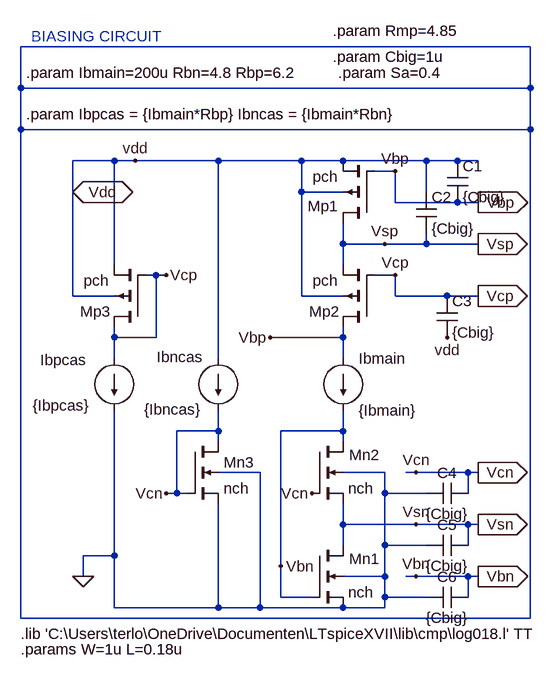
[diagram p0: schematic Biasing_circuit.asc]
Biasing_circuit.asc, the LTspice schematic file:
Version 4
SHEET 1 3816 872
WIRE 1984 -160 1200 -160
WIRE 1200 -96 1200 -160
WIRE 1984 -96 1984 -160
WIRE 1984 -96 1200 -96
WIRE 1200 -32 1200 -96
WIRE 1984 -32 1984 -96
WIRE 1984 -32 1200 -32
WIRE 1344 16 1280 16
WIRE 1376 16 1344 16
WIRE 1504 16 1376 16
WIRE 1632 16 1504 16
WIRE 1696 16 1632 16
WIRE 1824 16 1696 16
WIRE 1872 16 1824 16
WIRE 1904 16 1872 16
WIRE 1776 32 1744 32
WIRE 1280 64 1280 16
WIRE 1632 64 1632 16
WIRE 1696 64 1632 64
WIRE 1824 64 1824 16
WIRE 1776 80 1776 32
WIRE 1872 80 1776 80
WIRE 1904 80 1872 80
WIRE 1696 144 1696 112
WIRE 1760 144 1696 144
WIRE 1824 144 1824 128
WIRE 1824 144 1760 144
WIRE 1904 144 1824 144
WIRE 1344 176 1344 16
WIRE 1696 176 1696 144
WIRE 1408 192 1392 192
WIRE 1424 192 1408 192
WIRE 1776 192 1744 192
WIRE 1280 224 1280 64
WIRE 1344 224 1280 224
WIRE 1632 224 1632 64
WIRE 1696 224 1632 224
WIRE 1776 224 1776 192
WIRE 1856 224 1776 224
WIRE 1904 224 1856 224
WIRE 1344 288 1344 272
WIRE 1408 288 1408 192
WIRE 1408 288 1344 288
WIRE 1696 288 1696 272
WIRE 1696 288 1584 288
WIRE 1344 320 1344 288
WIRE 1504 320 1504 16
WIRE 1696 320 1696 288
WIRE 1504 432 1504 400
WIRE 1504 432 1440 432
WIRE 1696 432 1696 400
WIRE 1696 432 1600 432
WIRE 1504 448 1504 432
WIRE 1696 448 1696 432
WIRE 1568 496 1504 496
WIRE 1760 496 1696 496
WIRE 1808 496 1792 496
WIRE 1888 496 1808 496
WIRE 1904 496 1888 496
WIRE 1440 528 1440 432
WIRE 1440 528 1424 528
WIRE 1456 528 1440 528
WIRE 1760 528 1760 496
WIRE 1824 528 1760 528
WIRE 1888 528 1888 496
WIRE 1696 576 1696 544
WIRE 1808 576 1696 576
WIRE 1888 576 1808 576
WIRE 1904 576 1888 576
WIRE 1696 608 1696 576
WIRE 1760 608 1760 528
WIRE 1824 608 1760 608
WIRE 1888 608 1888 576
WIRE 1344 624 1344 400
WIRE 1344 624 1296 624
WIRE 1600 640 1600 432
WIRE 1296 656 1296 624
WIRE 1760 656 1760 608
WIRE 1760 656 1696 656
WIRE 1808 656 1792 656
WIRE 1888 656 1808 656
WIRE 1904 656 1888 656
WIRE 1600 688 1600 640
WIRE 1648 688 1600 688
WIRE 1760 688 1760 656
WIRE 1824 688 1760 688
WIRE 1888 688 1888 656
WIRE 1344 704 1344 624
WIRE 1504 704 1504 544
WIRE 1504 704 1344 704
WIRE 1568 704 1568 496
WIRE 1568 704 1504 704
WIRE 1696 704 1568 704
WIRE 1760 704 1760 688
WIRE 1760 704 1696 704
WIRE 1200 720 1200 -32
WIRE 1984 720 1984 -32
WIRE 1984 720 1200 720
FLAG 1376 16 vdd
FLAG 1760 144 Vsp
FLAG 1776 192 Vcp
FLAG 1776 32 Vbp
FLAG 1600 640 Vbn
FLAG 1808 656 Vbn
FLAG 1808 576 Vsn
FLAG 1808 496 Vcn
FLAG 1296 656 0
FLAG 1648 528 Vcn
FLAG 1424 528 Vcn
FLAG 1424 192 Vcp
FLAG 1584 288 Vbp
FLAG 1904 80 Vbp
IOPIN 1904 80 Out
FLAG 1904 144 Vsp
IOPIN 1904 144 Out
FLAG 1904 224 Vcp
IOPIN 1904 224 Out
FLAG 1904 496 Vcn
IOPIN 1904 496 Out
FLAG 1904 576 Vsn
IOPIN 1904 576 Out
FLAG 1904 656 Vbn
IOPIN 1904 656 Out
FLAG 1280 64 Vdd
IOPIN 1280 64 BiDir
FLAG 1856 288 vdd
DATAFLAG 1696 144 "round($*100)/100"
DATAFLAG 1792 80 "round($*100)/100"
SYMBOL nmos4 1648 448 R0
WINDOW 0 57 21 Left 2
SYMATTR InstName Mn2
SYMATTR Value nch
SYMATTR Value2 l={L} w={W} m={Sa*2}
SYMBOL current 1696 320 R0
WINDOW 123 0 0 Left 0
WINDOW 39 0 0 Left 0
SYMATTR InstName Ibmain
SYMATTR Value {Ibmain}
SYMBOL current 1504 320 R0
WINDOW 0 -95 -2 Left 2
WINDOW 3 -114 79 Left 2
WINDOW 123 0 0 Left 0
WINDOW 39 0 0 Left 0
SYMATTR InstName Ibncas
SYMATTR Value {Ibncas}
SYMBOL pmos4 1744 272 R180
WINDOW 0 53 24 Left 2
SYMATTR InstName Mp2
SYMATTR Value pch
SYMATTR Value2 l={L} w={W} m={Sa*Rmp*2}
SYMBOL pmos4 1744 112 R180
WINDOW 0 55 26 Left 2
SYMATTR InstName Mp1
SYMATTR Value pch
SYMATTR Value2 l={L} w={W} m={Sa*Rmp*2}
SYMBOL nmos4 1456 448 R0
SYMATTR InstName Mn3
SYMATTR Value nch
SYMATTR Value2 l={L} w={W} m={Sa*2}
SYMBOL current 1344 320 R0
WINDOW 0 -114 3 Left 2
WINDOW 3 -126 73 Left 2
WINDOW 123 0 0 Left 0
WINDOW 39 0 0 Left 0
SYMATTR InstName Ibpcas
SYMATTR Value {Ibpcas}
SYMBOL pmos4 1392 272 R180
WINDOW 0 53 24 Left 2
SYMATTR InstName Mp3
SYMATTR Value pch
SYMATTR Value2 l={L} w={W} m={Sa*Rmp*2}
SYMBOL nmos4 1648 608 R0
WINDOW 0 57 21 Left 2
SYMATTR InstName Mn1
SYMATTR Value nch
SYMATTR Value2 l={L} w={W} m={Sa*2}
SYMBOL cap 1856 16 R0
SYMATTR InstName C1
SYMATTR Value {Cbig}
SYMBOL cap 1808 64 R0
SYMATTR InstName C2
SYMATTR Value {Cbig}
SYMBOL cap 1840 224 R0
SYMATTR InstName C3
SYMATTR Value {Cbig}
SYMBOL cap 1824 544 R270
WINDOW 0 32 32 VTop 2
WINDOW 3 0 32 VBottom 2
SYMATTR InstName C4
SYMATTR Value {Cbig}
SYMBOL cap 1824 624 R270
WINDOW 0 32 32 VTop 2
WINDOW 3 0 32 VBottom 2
SYMATTR InstName C5
SYMATTR Value {Cbig}
SYMBOL cap 1824 704 R270
WINDOW 0 32 32 VTop 2
WINDOW 3 0 32 VBottom 2
SYMATTR InstName C6
SYMATTR Value {Cbig}
TEXT 1200 744 Left 2 !.lib 'C:\\Users\\terlo\\OneDrive\\Documenten\\LTspiceXVII\\lib\\cmp\\log018.l' TT
TEXT 1216 -176 Left 2 ;BIASING CIRCUIT
TEXT 1200 768 Left 2 !.params W=1u L=0.18u
TEXT 1208 -120 Left 2 !.param Ibmain=200u Rbn=4.8 Rbp=6.2
TEXT 1208 -56 Left 2 !.param Ibpcas = {Ibmain*Rbp} Ibncas = {Ibmain*Rbn}
TEXT 1680 -144 Left 2 !.param Cbig=1u
TEXT 1688 -120 Left 2 !.param Sa=0.4
TEXT 1680 -184 Left 2 !.param Rmp=4.85

The netlist it stands for:
* Biasing_circuit.asc
Mn2 Vbn Vcn Vsn 0 nch l={L} w={W} m={Sa*2}
Ibmain Vbp Vbn {Ibmain}
Ibncas vdd Vcn {Ibncas}
Mp2 Vbp Vcp Vsp vdd pch l={L} w={W} m={Sa*Rmp*2}
Mp1 Vsp Vbp vdd vdd pch l={L} w={W} m={Sa*Rmp*2}
Mn3 Vcn Vcn 0 0 nch l={L} w={W} m={Sa*2}
Ibpcas Vcp 0 {Ibpcas}
Mp3 Vcp Vcp vdd vdd pch l={L} w={W} m={Sa*Rmp*2}
Mn1 Vsn Vbn 0 0 nch l={L} w={W} m={Sa*2}
C1 vdd Vbp {Cbig}
C2 vdd Vsp {Cbig}
C3 Vcp vdd {Cbig}
C4 0 Vcn {Cbig}
C5 0 Vsn {Cbig}
C6 0 Vbn {Cbig}
.model NMOS NMOS
.model PMOS PMOS
.lib standard.mos
.lib 'C:\Users\terlo\OneDrive\Documenten\LTspiceXVII\lib\cmp\log018.l' TT
* BIASING CIRCUIT
.params W=1u L=0.18u
.param Ibmain=200u Rbn=4.8 Rbp=6.2
.param Ibpcas = {Ibmain*Rbp} Ibncas = {Ibmain*Rbn}
.param Cbig=1u
.param Sa=0.4
.param Rmp=4.85
.backanno
.end